# EAGLE design SenseThermo TEC - CRHVEF (EAGLE 9.2.2)
LICENSE: CERN OHL v1.2; REV: CRHVEF; TITLE: SenseTemp TEC; URL: https://github.com/CapableRobot/SenseTemp-TEC

## Sheet 1 of 4
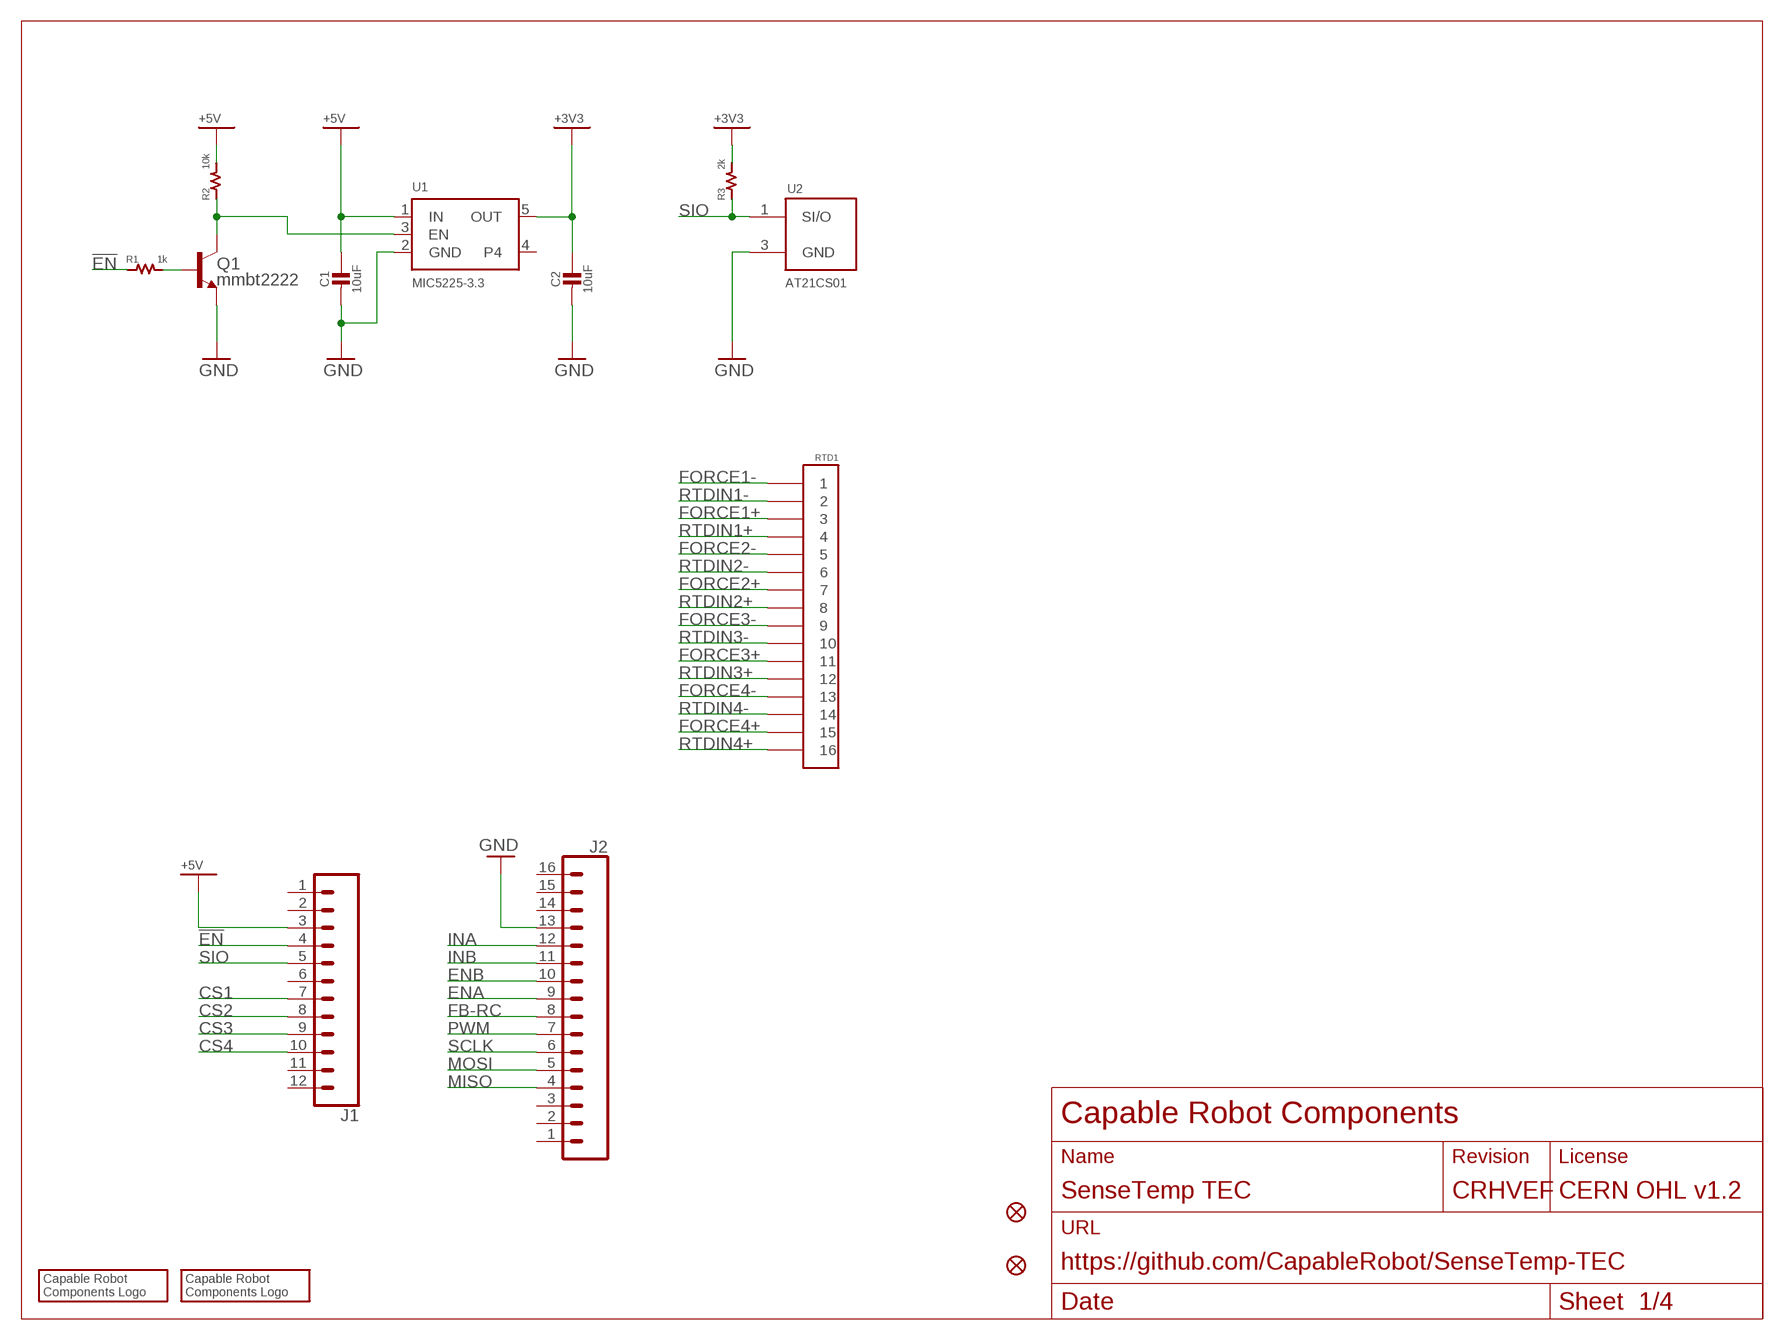
[diagram p0: schematic, sheet 1]

### Parts
C1  10uF  CAP_CERAMIC1206  [1206]
C2  10uF  CAP_CERAMIC1206  [1206]
FID1  FIDUCIAL""  [FIDUCIAL_1MM]
FID2  FIDUCIAL""  [FIDUCIAL_1MM]
J1  CONN_12NO_SILK  [1X12_NO_SILK]
J2  CONN_161X16_NO_SILK  [1X16_NO_SILK]
LOGO1  CRC-LOGO10  [CRC-LOGO-10]
LOGO2  CRC-LOGO5  [CRC-LOGO-5]
Q1  mmbt2222  TRANS_NPN-MMBT2222AL  [SOT23-3]
R1  1k  RES0603  [0603]
R2  10k  RES0603  [0603]
R3  2k  RES0603  [0603]
RTD1  CONN-16ZT  [CONN-2X8-050-SMT-ZT]
U1  MIC5225-3.3  VREG_SOT23-5  [SOT23-5]
U2  AT21CS01  [SOT23]

### Nets
!EN: J1.4 R1.1
+3V3: C2.1 R3.2 U1.5(OUT) ; also sheet 2,3,4
+5V: C1.1 J1.3 R2.2 U1.1(IN)
CS1: J1.7 ; also sheet 2
CS2: J1.8 ; also sheet 2
CS3: J1.9 ; also sheet 3
CS4: J1.10 ; also sheet 3
ENA: J2.9 ; also sheet 4
ENB: J2.10 ; also sheet 4
FB-RC: J2.8 ; also sheet 4
FORCE1+: RTD1.3 ; also sheet 2
FORCE1-: RTD1.1 ; also sheet 2
FORCE2+: RTD1.7 ; also sheet 2
FORCE2-: RTD1.5 ; also sheet 2
FORCE3+: RTD1.11 ; also sheet 3
FORCE3-: RTD1.9 ; also sheet 3
FORCE4+: RTD1.15 ; also sheet 3
FORCE4-: RTD1.13 ; also sheet 3
GND: C1.2 C2.2 J2.13 Q1.2(E) U1.2(GND) U2.3(GND) ; also sheet 2,3,4
INA: J2.12 ; also sheet 4
INB: J2.11 ; also sheet 4
MISO: J2.4 ; also sheet 2,3
MOSI: J2.5 ; also sheet 2,3
N$3: Q1.3(C) R2.1 U1.3(EN)
N$4: Q1.1(B) R1.2
PWM: J2.7 ; also sheet 4
RTDIN1+: RTD1.4 ; also sheet 2
RTDIN1-: RTD1.2 ; also sheet 2
RTDIN2+: RTD1.8 ; also sheet 2
RTDIN2-: RTD1.6 ; also sheet 2
RTDIN3+: RTD1.12 ; also sheet 3
RTDIN3-: RTD1.10 ; also sheet 3
RTDIN4+: RTD1.16 ; also sheet 3
RTDIN4-: RTD1.14 ; also sheet 3
SCLK: J2.6 ; also sheet 2,3
SIO: J1.5 R3.1 U2.1(SI/O)
Unconnected: J1.1 J1.2 J1.6 J1.11 J1.12 J2.1 J2.2 J2.3 J2.14 J2.15 J2.16 U1.4

## Sheet 2 of 4
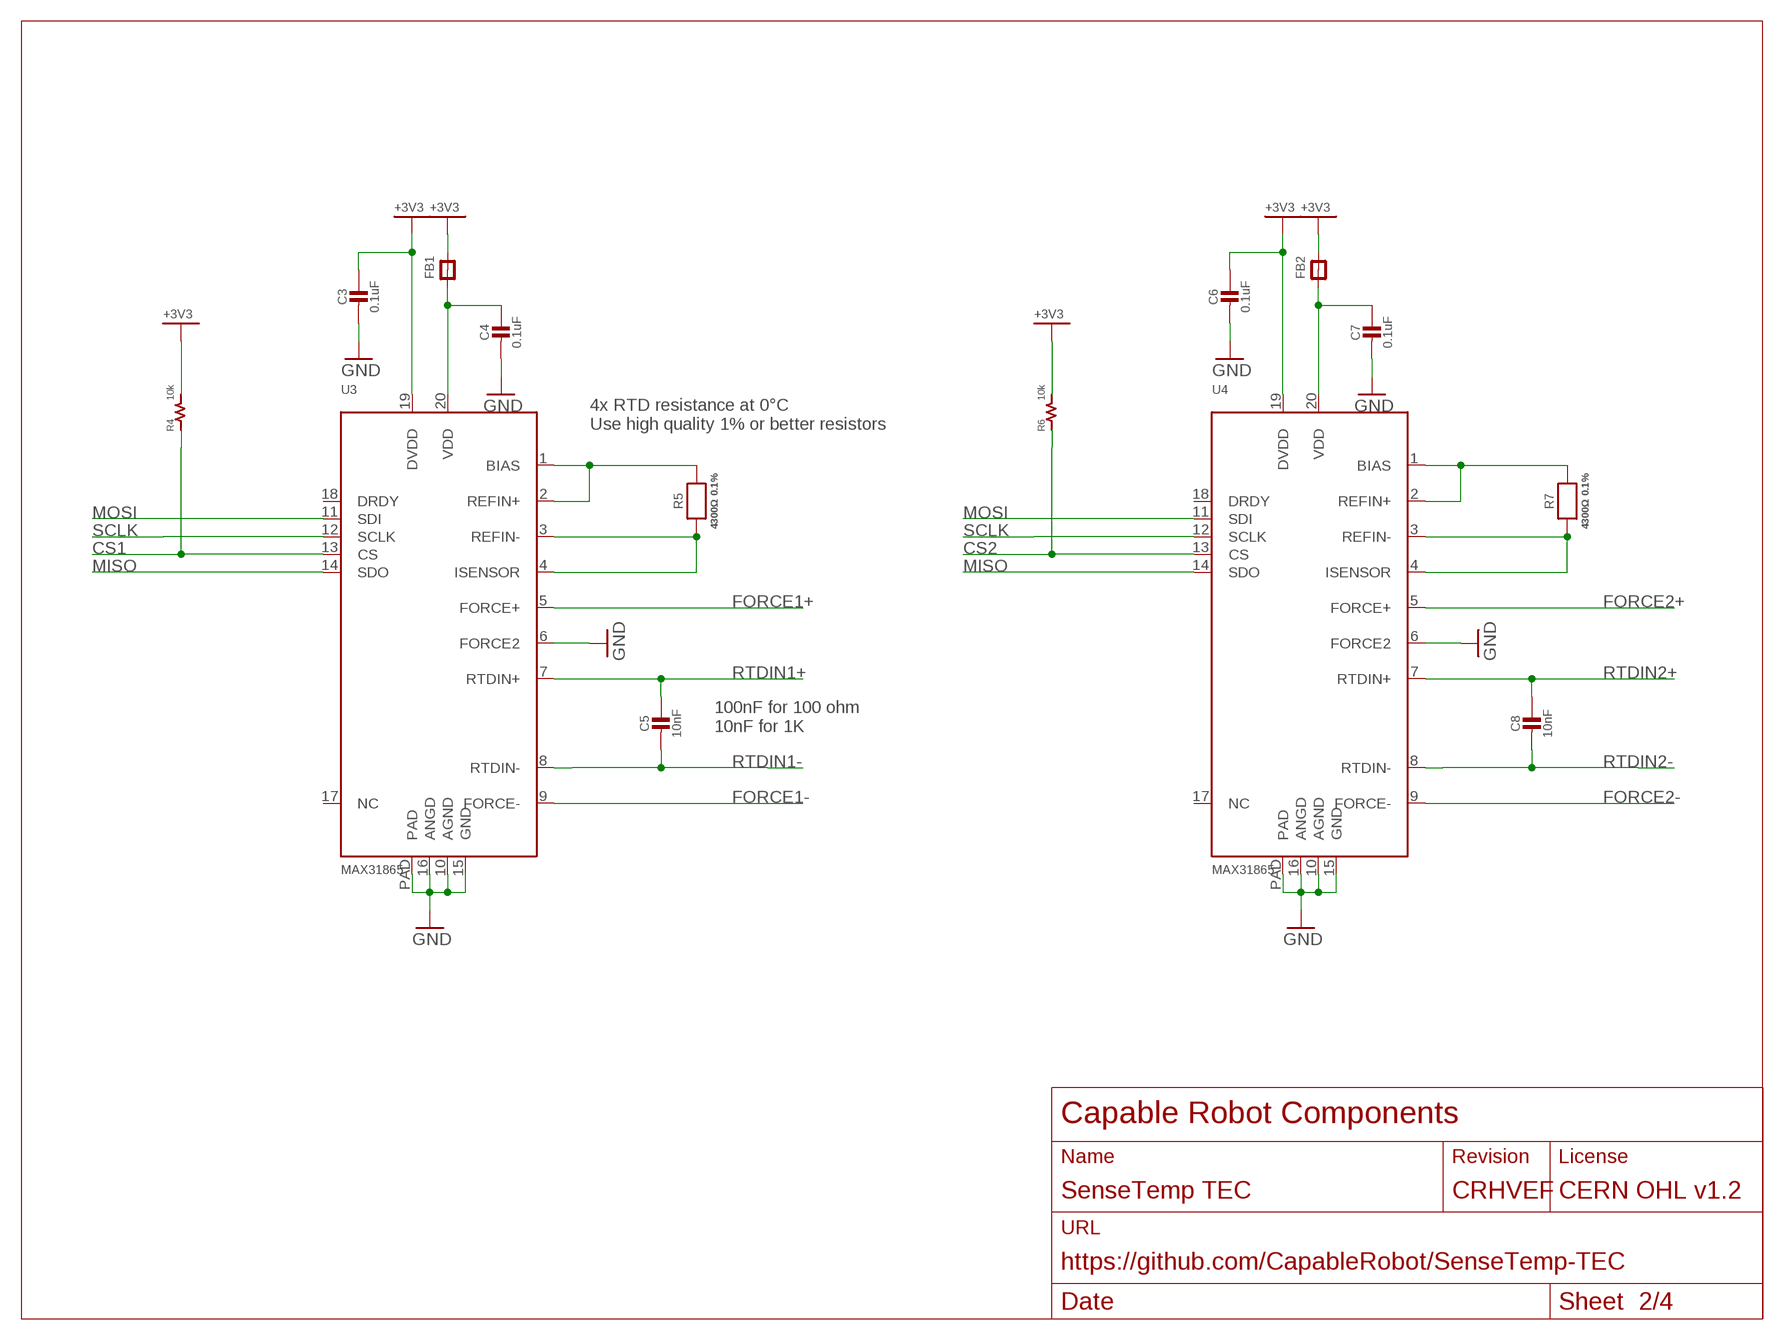
[diagram p1: schematic, sheet 2]

### Parts
C3  0.1uF  CAP_CERAMIC_0805MP  [_0805MP]
C4  0.1uF  CAP_CERAMIC_0805MP  [_0805MP]
C5  10nF  CAP_CERAMIC_0805MP  [_0805MP]
C6  0.1uF  CAP_CERAMIC_0805MP  [_0805MP]
C7  0.1uF  CAP_CERAMIC_0805MP  [_0805MP]
C8  10nF  CAP_CERAMIC_0805MP  [_0805MP]
FB1  FERRITE_0805MP  [_0805MP]
FB2  FERRITE_0805MP  [_0805MP]
R4  10k  RES0603  [0603]
R5  4300Ω 0.1%  RESISTOR_0805MP  [_0805MP]
R6  10k  RES0603  [0603]
R7  4300Ω 0.1%  RESISTOR_0805MP  [_0805MP]
U3  MAX31865  TEMP_MAX31865  [QFN20_4MM_0.65MM]
U4  MAX31865  TEMP_MAX31865  [QFN20_4MM_0.65MM]

### Nets
+3V3: C3.1 C6.1 FB1.2 FB2.2 R4.2 R6.2 U3.19(DVDD) U4.19(DVDD) ; also sheet 1,3,4
CS1: R4.1 U3.13(CS) ; also sheet 1
CS2: R6.1 U4.13(CS) ; also sheet 1
FORCE1+: U3.5(FORCE+) ; also sheet 1
FORCE1-: U3.9(FORCE-) ; also sheet 1
FORCE2+: U4.5(FORCE+) ; also sheet 1
FORCE2-: U4.9(FORCE-) ; also sheet 1
GND: C3.2 C4.2 C6.2 C7.2 U3.6(FORCE2) U3.10(AGND) U3.15(GND) U3.16(ANGD) U3.PAD U4.6(FORCE2) U4.10(AGND) U4.15(GND) U4.16(ANGD) U4.PAD ; also sheet 1,3,4
MISO: U3.14(SDO) U4.14(SDO) ; also sheet 1,3
MOSI: U3.11(SDI) U4.11(SDI) ; also sheet 1,3
N$5: R5.2 U3.1(BIAS) U3.2(REFIN+)
N$6: R5.1 U3.3(REFIN-) U3.4(ISENSOR)
N$7: C4.1 FB1.1 U3.20(VDD)
N$8: R7.2 U4.1(BIAS) U4.2(REFIN+)
N$9: R7.1 U4.3(REFIN-) U4.4(ISENSOR)
N$10: C7.1 FB2.1 U4.20(VDD)
RTDIN1+: C5.1 U3.7(RTDIN+) ; also sheet 1
RTDIN1-: C5.2 U3.8(RTDIN-) ; also sheet 1
RTDIN2+: C8.1 U4.7(RTDIN+) ; also sheet 1
RTDIN2-: C8.2 U4.8(RTDIN-) ; also sheet 1
SCLK: U3.12(SCLK) U4.12(SCLK) ; also sheet 1,3
Unconnected: U3.17(NC) U3.18(DRDY) U4.17(NC) U4.18(DRDY)

### Notes on the sheet
- 4x RTD resistance at 0°C 
  Use high quality 1% or better resistors
- 100nF for 100 ohm
  10nF for 1K

## Sheet 3 of 4
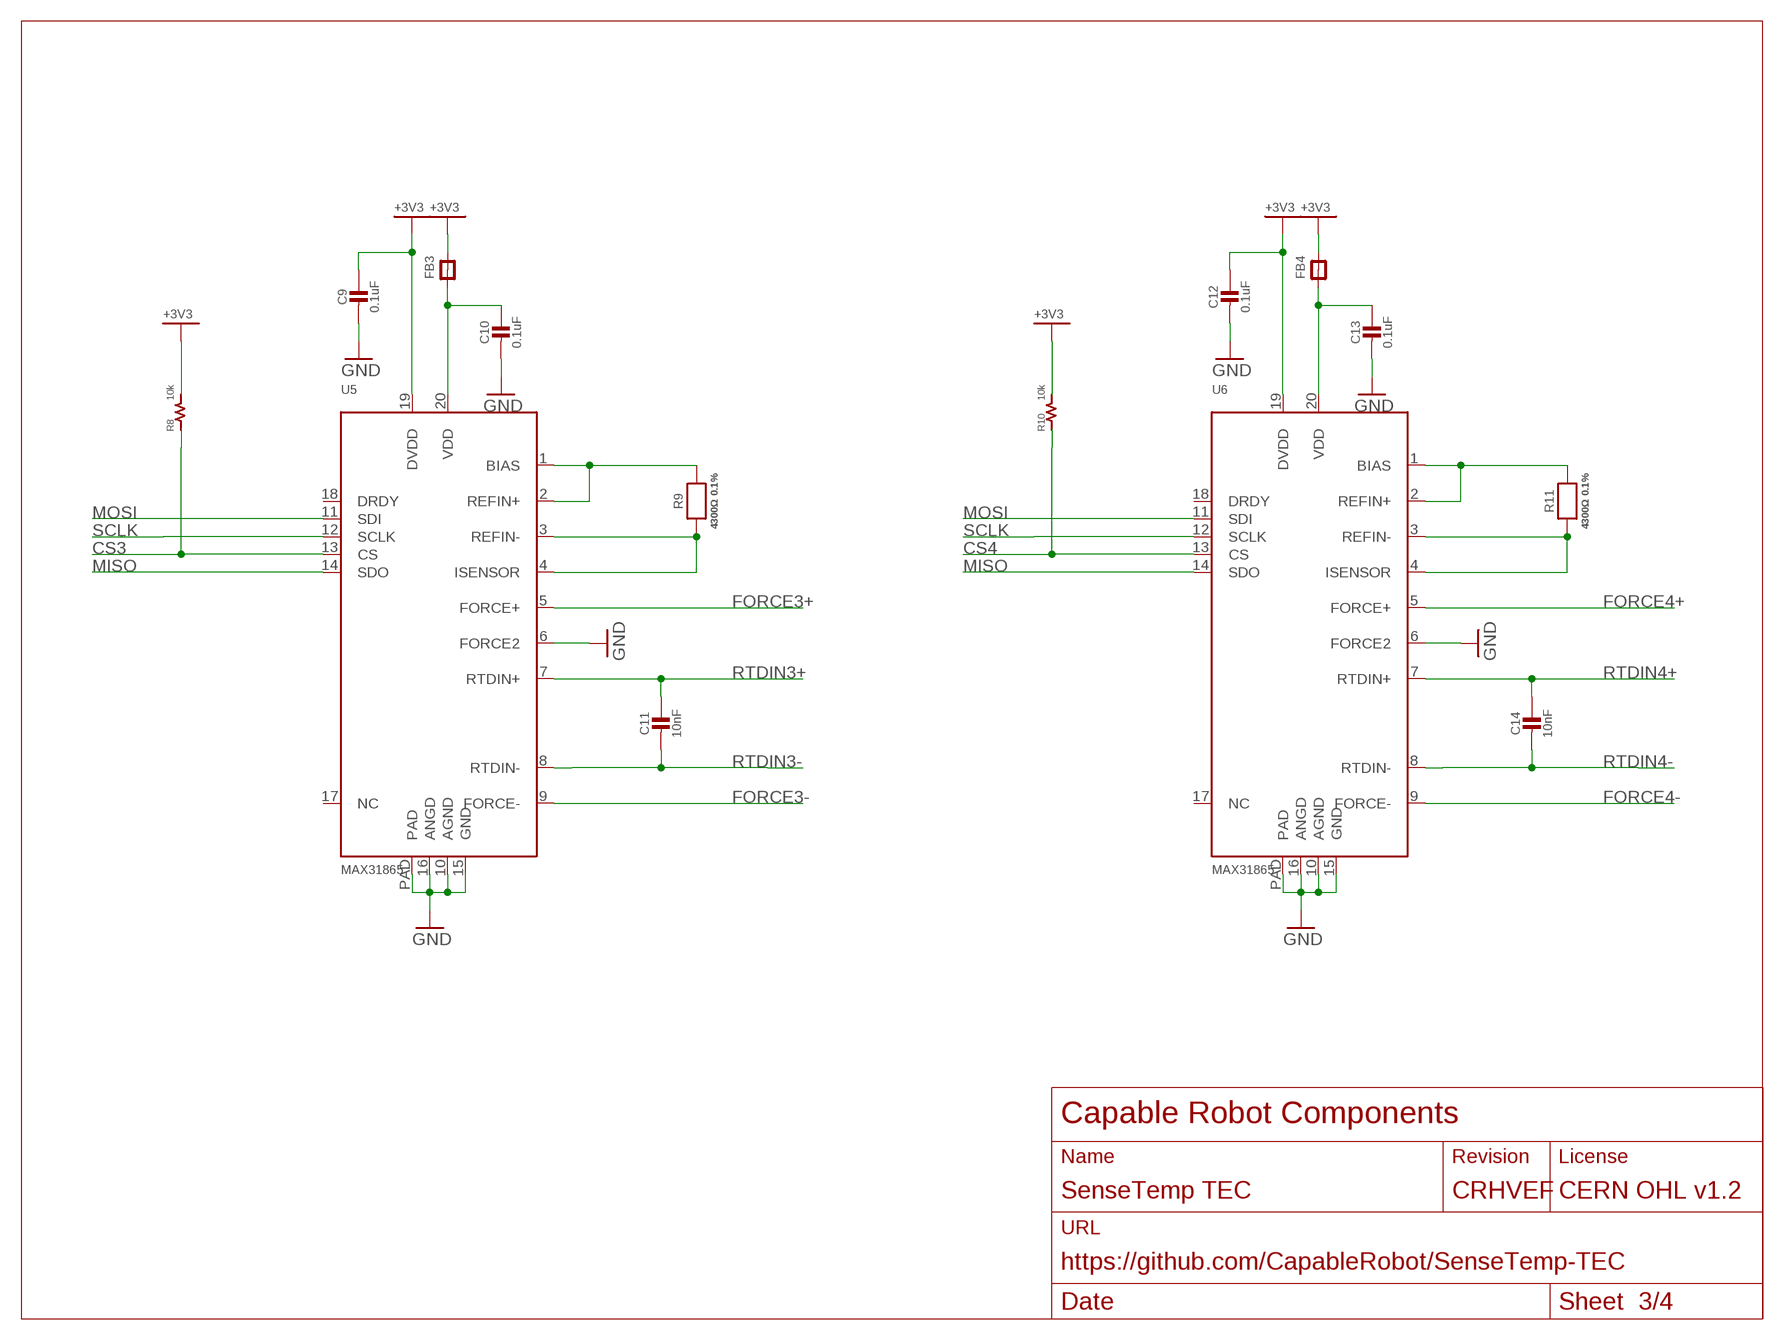
[diagram p2: schematic, sheet 3]

### Parts
C9  0.1uF  CAP_CERAMIC_0805MP  [_0805MP]
C10  0.1uF  CAP_CERAMIC_0805MP  [_0805MP]
C11  10nF  CAP_CERAMIC_0805MP  [_0805MP]
C12  0.1uF  CAP_CERAMIC_0805MP  [_0805MP]
C13  0.1uF  CAP_CERAMIC_0805MP  [_0805MP]
C14  10nF  CAP_CERAMIC_0805MP  [_0805MP]
FB3  FERRITE_0805MP  [_0805MP]
FB4  FERRITE_0805MP  [_0805MP]
R8  10k  RES0603  [0603]
R9  4300Ω 0.1%  RESISTOR_0805MP  [_0805MP]
R10  10k  RES0603  [0603]
R11  4300Ω 0.1%  RESISTOR_0805MP  [_0805MP]
U5  MAX31865  TEMP_MAX31865  [QFN20_4MM_0.65MM]
U6  MAX31865  TEMP_MAX31865  [QFN20_4MM_0.65MM]

### Nets
+3V3: C9.1 C12.1 FB3.2 FB4.2 R8.2 R10.2 U5.19(DVDD) U6.19(DVDD) ; also sheet 1,2,4
CS3: R8.1 U5.13(CS) ; also sheet 1
CS4: R10.1 U6.13(CS) ; also sheet 1
FORCE3+: U5.5(FORCE+) ; also sheet 1
FORCE3-: U5.9(FORCE-) ; also sheet 1
FORCE4+: U6.5(FORCE+) ; also sheet 1
FORCE4-: U6.9(FORCE-) ; also sheet 1
GND: C9.2 C10.2 C12.2 C13.2 U5.6(FORCE2) U5.10(AGND) U5.15(GND) U5.16(ANGD) U5.PAD U6.6(FORCE2) U6.10(AGND) U6.15(GND) U6.16(ANGD) U6.PAD ; also sheet 1,2,4
MISO: U5.14(SDO) U6.14(SDO) ; also sheet 1,2
MOSI: U5.11(SDI) U6.11(SDI) ; also sheet 1,2
N$11: R9.2 U5.1(BIAS) U5.2(REFIN+)
N$12: R9.1 U5.3(REFIN-) U5.4(ISENSOR)
N$13: C10.1 FB3.1 U5.20(VDD)
N$14: R11.2 U6.1(BIAS) U6.2(REFIN+)
N$15: R11.1 U6.3(REFIN-) U6.4(ISENSOR)
N$16: C13.1 FB4.1 U6.20(VDD)
RTDIN3+: C11.1 U5.7(RTDIN+) ; also sheet 1
RTDIN3-: C11.2 U5.8(RTDIN-) ; also sheet 1
RTDIN4+: C14.1 U6.7(RTDIN+) ; also sheet 1
RTDIN4-: C14.2 U6.8(RTDIN-) ; also sheet 1
SCLK: U5.12(SCLK) U6.12(SCLK) ; also sheet 1,2
Unconnected: U5.17(NC) U5.18(DRDY) U6.17(NC) U6.18(DRDY)

## Sheet 4 of 4
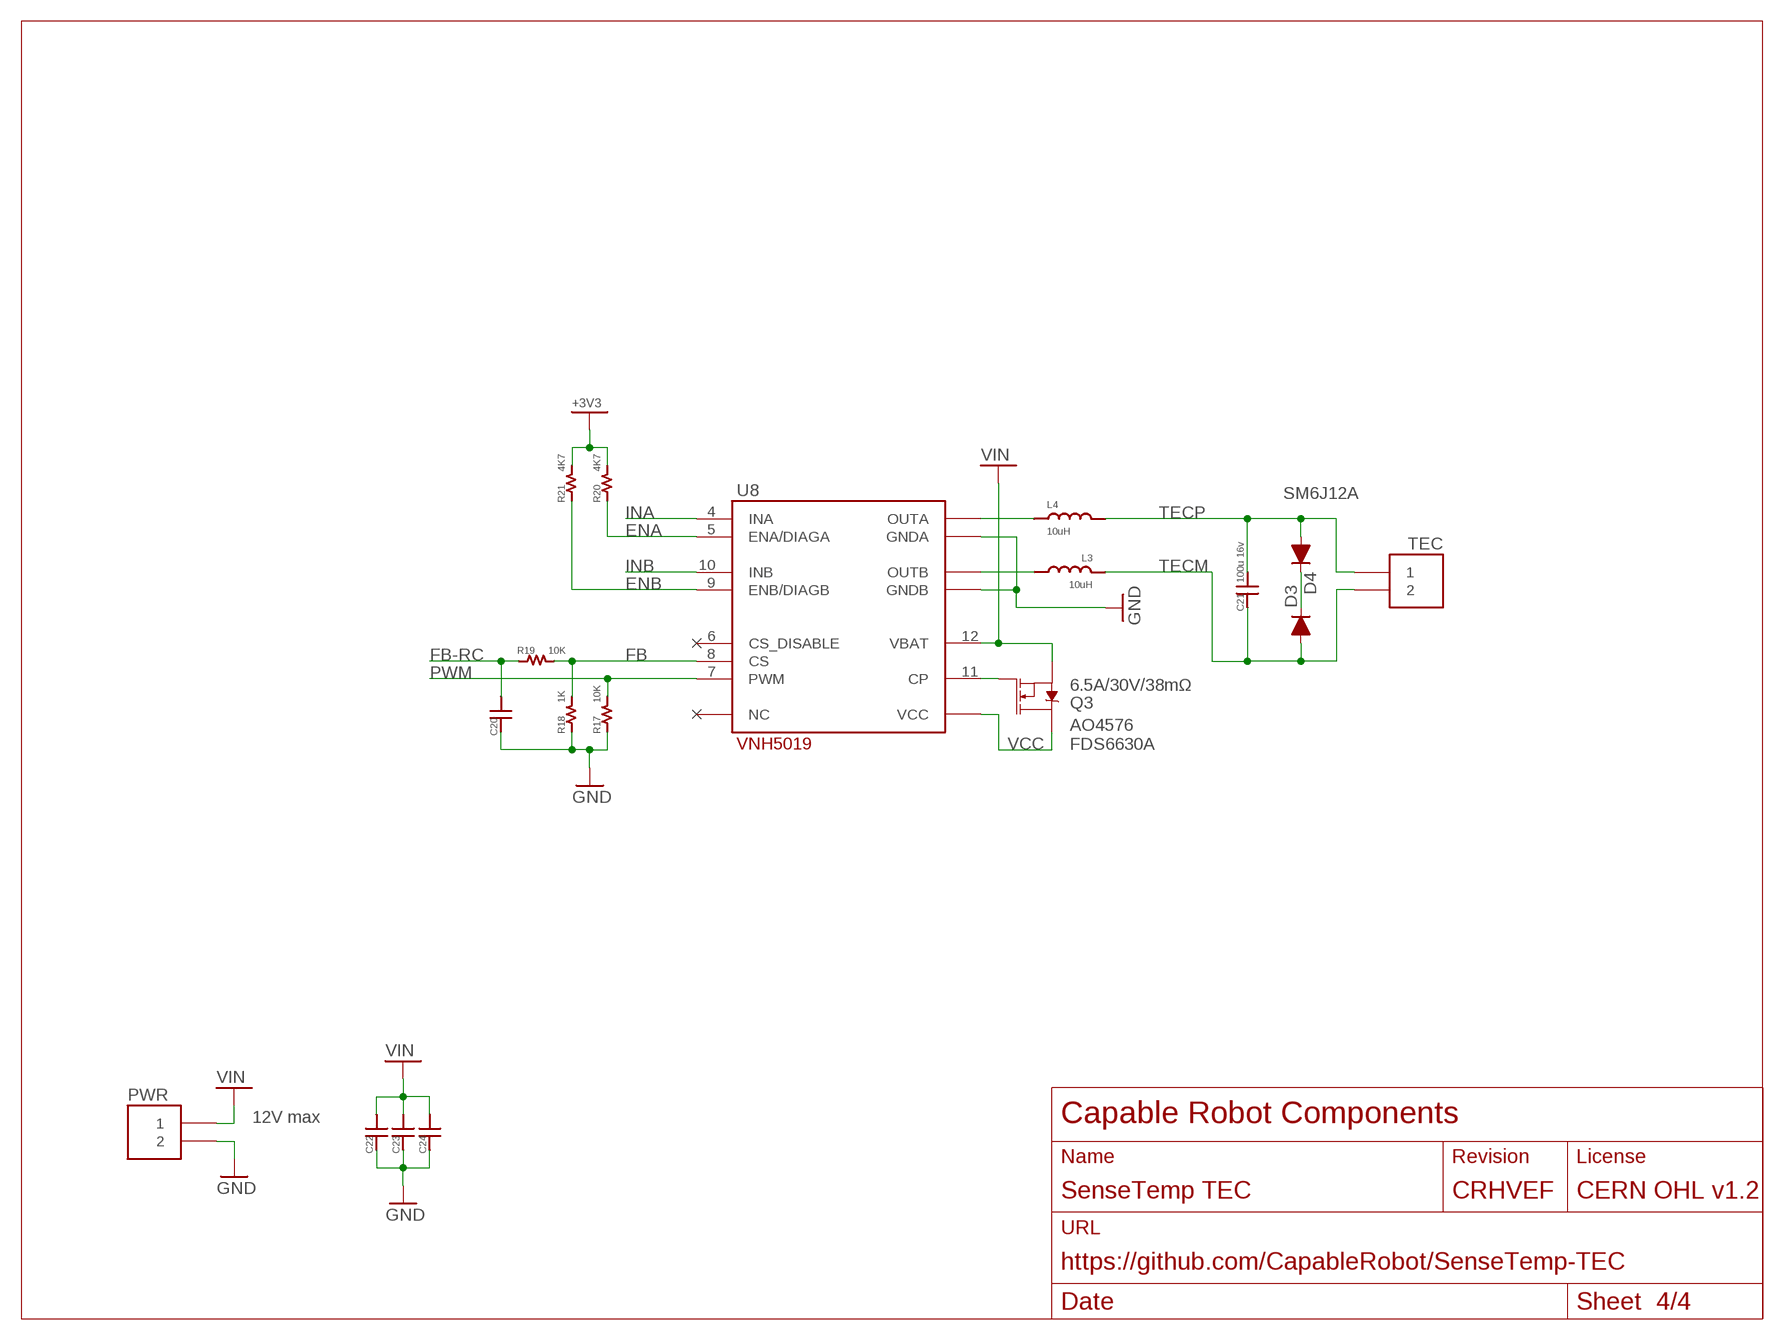
[diagram p3: schematic, sheet 4]

### Parts
C20  CAP0603  [0603]
C21  100u 16v  CAP2220  [2220]
C22  CAP1206  [1206]
C23  CAP1206  [1206]
C24  CAP1206  [1206]
D3  SM6J12A  DIODEDO214AA  [DO214AA]
D4  SMAJ12A  DIODEDO214AA  [DO214AA]
L3  10uH  INDHCF1007  [IND-HCF1007]
L4  10uH  INDHCF1007  [IND-HCF1007]
PWR  CONN-2-MFJR-RA  [CONN-MFJR-RA-2X1]
Q3  6.5A/30V/38mΩ  MOSFET-NCH-FDS6630A  [SO08]
R17  10K  RES0603  [0603]
R18  1K  RES0603  [0603]
R19  10K  RES0603  [0603]
R20  4K7  RES0603  [0603]
R21  4K7  RES0603  [0603]
TEC  CONN-2-MFJR-RA  [CONN-MFJR-RA-2X1]
U8  VNH5019  [SOP100P1900X235-30-EP]

### Nets
+3V3: R20.2 R21.2 ; also sheet 1,2,3
CP1: Q3.4(G) U8.11(CP)
ENA: R20.1 U8.5(ENA/DIAGA) ; also sheet 1
ENB: R21.1 U8.9(ENB/DIAGB) ; also sheet 1
FB: R18.2 R19.2 U8.8(CS)
FB-RC: C20.2 R19.1 ; also sheet 1
GND: C20.1 C22.P$1 C23.P$1 C24.P$1 PWR.2 R17.1 R18.1 U8.18(GNDB) U8.19(GNDB) U8.20(GNDB) U8.26(GNDA) U8.27(GNDA) U8.28(GNDA) ; also sheet 1,2,3
INA: U8.4(INA) ; also sheet 1
INB: U8.10(INB) ; also sheet 1
OUTA1: L4.1 U8.1(OUTA) U8.25(OUTA) U8.30(OUTA) U8.OUTA
OUTB1: L3.2 U8.15(OUTB) U8.16(OUTB) U8.21(OUTB) U8.OUTB
PWM: R17.2 U8.7(PWM) ; also sheet 1
SNUB1: D3.C D4.C
TECM: C21.1 D3.A L3.1 TEC.2
TECP: C21.2 D4.A L4.2 TEC.1
VCC: Q3.5(D) Q3.6(D) Q3.7(D) Q3.8(D) U8.3(VCC) U8.13(VCC) U8.23(VCC) U8.VCC
VIN: C22.P$2 C23.P$2 C24.P$2 PWR.1 Q3.1(S) Q3.2(S) Q3.3(S) U8.12(VBAT)
Unconnected: U8.2(NC) U8.6(CS_DISABLE) U8.14(NC) U8.17(NC) U8.22(NC) U8.24(NC) U8.29(NC)

### Notes on the sheet
- AO4576
  FDS6630A
- 12V max

## Library data of the parts
C1-C14 = microbuilder:CAP_CERAMIC: Ceramic Capacitors 0402 - 0402 Surface Mount Capacitors 16pF 50V 5% [Digikey: 445-4899-2-ND] 18pF 50V 5% [Digikey: 490-1281-2-ND] 22pF 50V 5% [Digikey: 490-1283-2-ND] 68pF 50V 5% [Digikey: 490-1289-2-ND] 0.1uF 10V 10% [Digikey: 490-1318-2-ND] 1.0uF 6.3V 10% [Digikey: 490-1320-2-ND] 0603 - 0603 Surface Mount Capacitors 16 pF 50V 5% [Digikey: 445-5051-2-ND] 22 pF 50V [Digikey: PCC220ACVTR-ND] 33 pF 50V 5% [Digikey: 490-1415-1-ND] 56pF 50V 5% [Digikey: 490-1421-1-ND] 220pF 50V 5% [Digikey: 445-1285-1-ND] 680 pF 50V 2200 pF 50V 5% C0G [Digikey: 445-1297-1-ND] 5600 pF 100V 5% X7R [Digikey: 478-3711-1-ND] 0.1 µF 25V 10% [Digikey: PCC2277TR-ND] 0.22 µF 16V 10% X7R [Digikey: 445-1318-1-ND] 1.0 µF 25V 10% [Digikey: 445-5146-2-ND] 0603 - RF Specific 3pF 250V +/-0.1pF RF [Digikey: 712-1347-1-ND] 18 pF 250V 5% [Digikey: 478-3505-1-ND or 712-1322-1-ND] 56 pF 250V 5% C0G RF [Digikey: 490-4867-1-ND] 68 pF 250V RF [Digikey: 490-4868-1-ND] 0805 - 0805 Surface Mount Capacitors 220 pF 250V 2% RF Ceramic Capacitor [Digikey: 712-1398-1-ND] 1000 pF 50V 2% NP0 Ceramic Capacitor [Digikey: 478-3760-1-ND] 0.1 µF 25V 10% Ceramic Capacitor [Digikey: PCC1828TR-ND] 1.0 µF 16V 10% Ceramic Capacitor[Digikey: 490-1691-2-ND] 10.0 µF 10V 10% Ceramic Capacitor[Digikey: 709-1228-1-ND] 10.0 uF 16V 10% Ceramic Capacitor [Digikey: 478-5165-2-ND] 47 uF 6.3V 20% Ceramic Capacitor [Digikey: 587-1779-1-ND or 399-5506-1-ND] 1206 - 1206 Surface Mount Capacitors 47uF 10V 20% Ceramic Capacitor [Digikey: 490-5528-1-ND or 399-5508-1-ND or 445-6010-1-ND] 100uF 6.3V -20%, +80% Y5V Ceramic Capacitor (Digikey: 490-4512-1-ND, Mouser: 81-GRM31CF50J107ZE1L)
C20-C24 = CapableRobot:CAP
D3 D4 = EEZ MyLib7:DIODE
FB1-FB4 = microbuilder:FERRITE: Ferrite Bead 0603 MMZ1608B121C - 120 Ohm @ 100MHz, 600mA, 0.15 Ohm DC Resistance - Digikey: 445-2164-1-ND BK1608HW121-T - 120 Ohm, 600mA Ferrite Chip - Digikey: 587-1876-2-ND 0805 HZ0805B272R-10 - 2.7K Ohm @ 100MHz, 200mA, 0.8 Ohm DC Resistance - Digikey: 240-2504-1-ND (see also Murata BLM21BD272SN1L) MMZ2012Y152B - 1.5K Ohm @ 100MHz, 500mA, 0.4 Ohm DC Resistance - Digikey: 445-1560-1-ND - Mainly for high frequency (80-400MHz) MMZ2012R102A - 1K Ohm @ 100MHz, 500mA, 0.3 Ohm DC Resistance - Digikey: 445-1555-2-ND - More general purpose (10-200MHz)
FID1 FID2 = microbuilder:FIDUCIAL: Fiducial Alignment Points Various fiducial points for machine vision alignment.
J1 = SparkFun-Connectors:CONN_12: Multi connection point. Often used as Generic Header-pin footprint for 0.1 inch spaced/style header connections On any of the 0.1 inch spaced packages, you can populate with these: Break Away Headers - Straight <https://www.sparkfun.com/products/116> (PRT-00116) Break Away Male Headers - Right Angle <https://www.sparkfun.com/products/553> (PRT-00553) Female Headers <https://www.sparkfun.com/products/115> (PRT-00115) Break Away Headers - Machine Pin <https://www.sparkfun.com/products/117> (PRT-00117) Break Away Female Headers - Swiss Machine Pin <https://www.sparkfun.com/products/743> (PRT-00743) For SCREWTERMINALS and SPRING TERMINALS visit here: Screw Terimnals on SparkFun.com <https://www.sparkfun.com/search/results?term=Screw+Terminals> (5mm/3.5mm/2.54mm spacing) This device is also useful as a general connection point to wire up your design to another part of your project. Our various solder wires solder well into these plated through hole pads. Hook-Up Wire - Assortment (Stranded, 22 AWG) <https://www.sparkfun.com/products/11375> (PRT-11375) Hook-Up Wire - Assortment (Solid Core, 22 AWG) <https://www.sparkfun.com/products/11367> (PRT-11367) View the entire wire category on our website here <https://www.sparkfun.com/categories/141> Special notes: Molex polarized connector foot print use with SKU : PRT-08231 with associated crimp pins and housings. 1MM SMD Version SKU: PRT-10208 NOTES ON THE VARIANTS LOCK and LOCK_LONGPADS... This footprint was designed to help hold the alignment of a through-hole component (i.e. 6-pin header) while soldering it into place. You may notice that each hole has been shifted either up or down by 0.005 of an inch from it's more standard position (which is a perfectly straight line). This slight alteration caused the pins (the squares in the middle) to touch the edges of the holes. Because they are alternating, it causes a "brace" to hold the component in place. 0.005 has proven to be the perfect amount of "off-center" position when using our standard breakaway headers. Although looks a little odd when you look at the bare footprint, once you have a header in there, the alteration is very hard to notice. Also,if you push a header all the way into place, it is covered up entirely on the bottom side.
J2 = SparkFun-Connectors:CONN_16: Multi connection point. Often used as Generic Header-pin footprint for 0.1 inch spaced/style header connections On any of the 0.1 inch spaced packages, you can populate with these: Break Away Headers - Straight <https://www.sparkfun.com/products/116> (PRT-00116) Break Away Male Headers - Right Angle <https://www.sparkfun.com/products/553> (PRT-00553) Female Headers <https://www.sparkfun.com/products/115> (PRT-00115) Break Away Headers - Machine Pin <https://www.sparkfun.com/products/117> (PRT-00117) Break Away Female Headers - Swiss Machine Pin <https://www.sparkfun.com/products/743> (PRT-00743) For SCREWTERMINALS and SPRING TERMINALS visit here: Screw Terimnals on SparkFun.com <https://www.sparkfun.com/search/results?term=Screw+Terminals> (5mm/3.5mm/2.54mm spacing) This device is also useful as a general connection point to wire up your design to another part of your project. Our various solder wires solder well into these plated through hole pads. Hook-Up Wire - Assortment (Stranded, 22 AWG) <https://www.sparkfun.com/products/11375> (PRT-11375) Hook-Up Wire - Assortment (Solid Core, 22 AWG) <https://www.sparkfun.com/products/11367> (PRT-11367) View the entire wire category on our website here <https://www.sparkfun.com/categories/141> Special notes: Molex polarized connector foot print use with SKU : PRT-08231 with associated crimp pins and housings. 1MM SMD Version SKU: PRT-10208 NOTES ON THE VARIANTS LOCK and LOCK_LONGPADS... This footprint was designed to help hold the alignment of a through-hole component (i.e. 6-pin header) while soldering it into place. You may notice that each hole has been shifted either up or down by 0.005 of an inch from it's more standard position (which is a perfectly straight line). This slight alteration caused the pins (the squares in the middle) to touch the edges of the holes. Because they are alternating, it causes a "brace" to hold the component in place. 0.005 has proven to be the perfect amount of "off-center" position when using our standard breakaway headers. Although looks a little odd when you look at the bare footprint, once you have a header in there, the alteration is very hard to notice. Also,if you push a header all the way into place, it is covered up entirely on the bottom side.
L3 L4 = CapableRobot:IND: Shielded Power Inductor 1212 - Bourns SRFN03500145 1212 - Murata LQH3N SRN4018 - Bourns (4 x 4 x 2) MSS5131 - Coilcraft MSS5131 (5.1 x 5.1 x 3.1) SD53 - Cooper Ind SD53 (5.2 x 5.2 x 3.0) octagonal
LOGO1 LOGO2 = CapableRobot:CRC-LOGO
PWR TEC = CapableRobot:CONN-2
Q1 = SparkFun-DiscreteSemi:TRANS_NPN: NPN transistor Current controlled devices typically used to amplify current or used as a switch. BC547 - COM-08928 <http://www.sparkfun.com/products/8928> (TO-92 45V 100mA) (1.Collector 2.Base 3.Emitter) 2N3904 - COM-00521 <http://www.sparkfun.com/products/521> (TO-92 40V 200mA) (1.Emitter 2.Base 3.Collector) P2N2222A - COM-12852 <http://www.sparkfun.com/products/12852> (TO-92 40V 600mA) (1.Collector 2.Base 3.Emitter); PROD_ID: TRANS-08049; VALUE: 600mA/40V
Q3 = SparkFun-DiscreteSemi:MOSFET-NCH: N-channel MOSFETs Voltage controlled devices that allow control of high current outputs. SparkFun Products: SparkFun OpenScale <https://www.sparkfun.com/products/13261> SparkFun Digital Sandbox <https://www.sparkfun.com/products/12651> SparkFun Monster Moto Shield <https://www.sparkfun.com/products/10182> SparkFun MOSFET Power Controller <https://www.sparkfun.com/products/11214>; PROD_ID: TRANS-08089
R1-R4 R6 R8 R10 R17-R21 = CapableRobot:RES
R5 R7 R9 R11 = microbuilder:RESISTOR: Resistors 0402 - 0402 Surface Mount Package 22 Ohm 1% 1/16W [Digikey: 311-22.0LRTR-ND] 33 Ohm 5% 1/16W 1.0K 5% 1/16W 1.5K 5% 1/16W 2.0K 1% 1/16W 10.0K 1% 1/16W [Digikey: 311-10.0KLRTR-ND] 10.0K 5% 1/16W [Digikey: RMCF0402JT10K0TR-ND] 12.1K 1% 1/16W [Digikey: 311-22.0LRTR-ND] 100.0K 5% 1/16W 0603 - 0603 Surface Mount Package 0 Ohm 1/10 Watt 1% Resistor 15 Ohm 1/10 Watt 1% Resistor 33 Ohm 1/10 Watt 1% Resistor 49.9 Ohm 1/10 Watt 1% Resistor 100 Ohm 1/10 Watt 1% Resistor 150 Ohm 1/10 Watt 1% Resistor 240 Ohm 1/10 Watt 1% Resistor 390 Ohm 1/10 Watt 1% Resistor 560 Ohm 1/10 Watt 1% Resistor 680 Ohm 1/10 Watt 1% Resistor 750 Ohm 1/10 Watt 1% Resistor 1.0K Ohm 1/10 Watt 1% Resistor 1.5K Ohm 1/10 Watt 1% Resistor 2.0K Ohm 1/10 Watt 1% Resistor 2.2K Ohm 1/10 Watt 1% Resistor 3.3K Ohm 1/10 Watt 1% Resistor 4.7K Ohm 1/10 Watt 1% Resistor 10.0K Ohm 1/10 Watt 1% Resistor 12.0K Ohm 1/10 Watt 1% Resistor 12.1K Ohm 1/10 Watt 1% Resistor 20.0K Ohm 1/10 Watt 1% Resistor 33.0K Ohm 1/10 Watt 1% Resistor 100.0K Ohm 1/10 Watt 1% Resistor 0805 - 0805 Surface Mount Package 0 Ohm 1/8 Watt 1% Resistor 33 Ohm 1/8 Watt 1% Resistor 100 Ohm 1/8 Watt 1% Resistor 150 Ohm 1/8 Watt 1% Resistor 200 Ohm 1/8 Watt 1% Resistor 240 Ohm 1/8 Watt 1% Resistor 330 Ohm 1/8 Watt 1% Resistor 390 Ohm 1/8 Watt 1% Resistor 470 Ohm 1/8 Watt 1% Resistor 1.0K Ohm 1/8 Watt 1% Resistor 1.5K Ohm 1/8 Watt 1% Resistor 2.0K Ohm 1/8 Watt 1% Resistor 4.7K Ohm 1/8 Watt 1% Resistor 5.1K Ohm 1/8 Watt 1% Resistor 5.6K Ohm 1/8 Watt 1% Resistor 10.0K Ohm 1/8 Watt 1% Resistor 22.0K Ohm 1/8 Watt 1% Resistor 33.0K Ohm 1/8 Watt 1% Resistor 100K Ohm 1/8 Watt 1% Resistor 1206 - 1206 Surface Mount Package 2012 - 2010 Surface Mount Package 0.11 Ohm 1/2 Watt 1% Resistor - Digikey: RHM.11UCT-ND
RTD1 = CapableRobot:CONN-16
U1 = microbuilder:VREG_SOT23-5: SOT23-5 Fixed Voltage Regulators To better organise some of the SOT23-5 fixed voltage regulators in this library, this new part was created. Part Current Out V Out V In V Dropout Digikey Part No. ADP121 150mA 3.3V 3.4-5.5V 0.09V @ 150mA ADP121-AUJZ33R7CT-ND ADP121 150mA 3.0V 3.1-5.5V 0.09V @ 150mA ADP121-AUJZ30R7CT-ND ADP122 300mA 3.3V 3.4-5.5V 0.085V @ 300mA ADP122AUJZ-3.3-R7CT-ND ADP1712 300mA 3.3V 3.5-5.5V 0.17V @ 300mA ADP1712AUJZ-3.3-R7TR-ND AP7311 (Low Cost) 150mA 3.3V 3.5-6V 0.15V @ 150mA AP7311-33WG-7DICT-ND LD39015M18R 150mA 1.8V 1.9V-5.5V 0.08V @ 100mA 497-6977-1-ND MCP1824T-3302E/OT 300mA 3.3V 3.5V-6V 0.2V @ 300mA MCP1824T-3302E/OTCT-ND MIC5205-2.5YM5 TR 150mA 2.5V 2.7-16V 0.165V @ 150mA 576-1257-2-ND MIC5205-3.0YM5 TR 150mA 3.0V 3.2V-16V 0.165V @ 150mA 576-1258-2-ND MIC5205-3.3YM5 TR 150mA 3.3V 3.5V-16V 0.165V @ 150mA 576-1259-2-ND TPS780330220 150mA 3.3V+2.2V 3.6-5.5V 250mV Max 296-23332-1-ND TDA3663/N1,135 100mA 3.3V 3.5-45V 0.18V @ 50mA 568-5343-1-ND
U2 = CapableRobot:AT21CS01: Single-Wire, I/O Powered 1-Kbit (128 x 8) Serial EEPROM with a Unique, Factory-Programmed 64-Bit Serial Number
U3-U6 = microbuilder:TEMP_MAX31865: MAX31865 - Resistance to Digital Convertor for Platinum Resistance Temperature Detectors (RTDs) Handles 100 ohm - 1K ohm (at 0°C) platinum RTDs. 15-bit ADC resolution (nominally 0.03125°C), 0.5°C accuracy.
U8 = CapableRobot:VNH5019

## Board
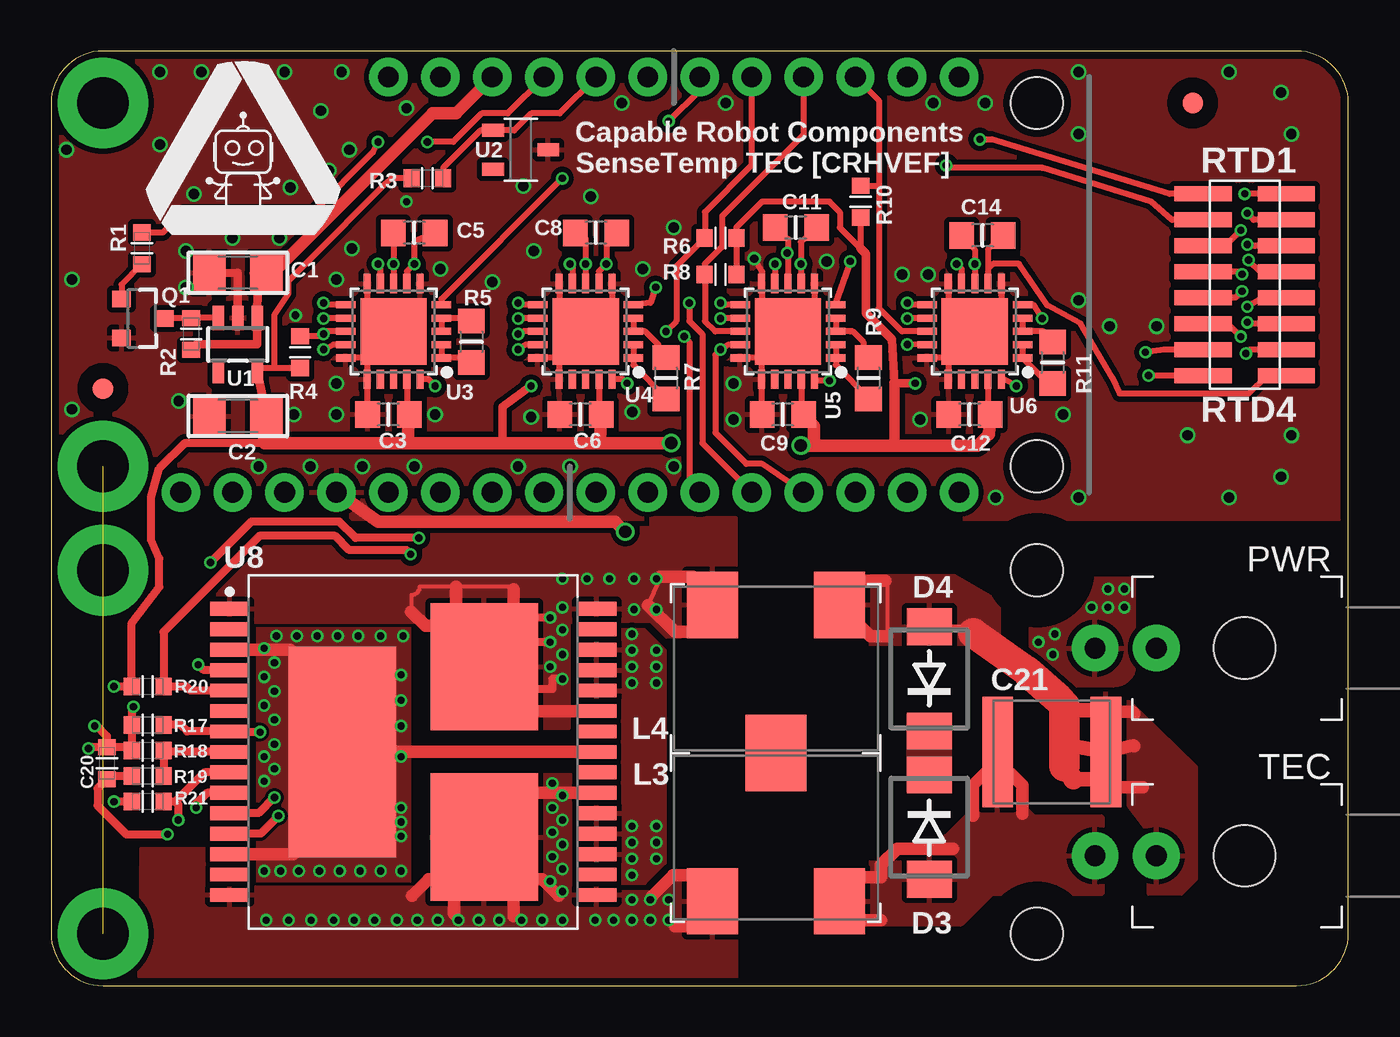
[diagram p4: board, top side]
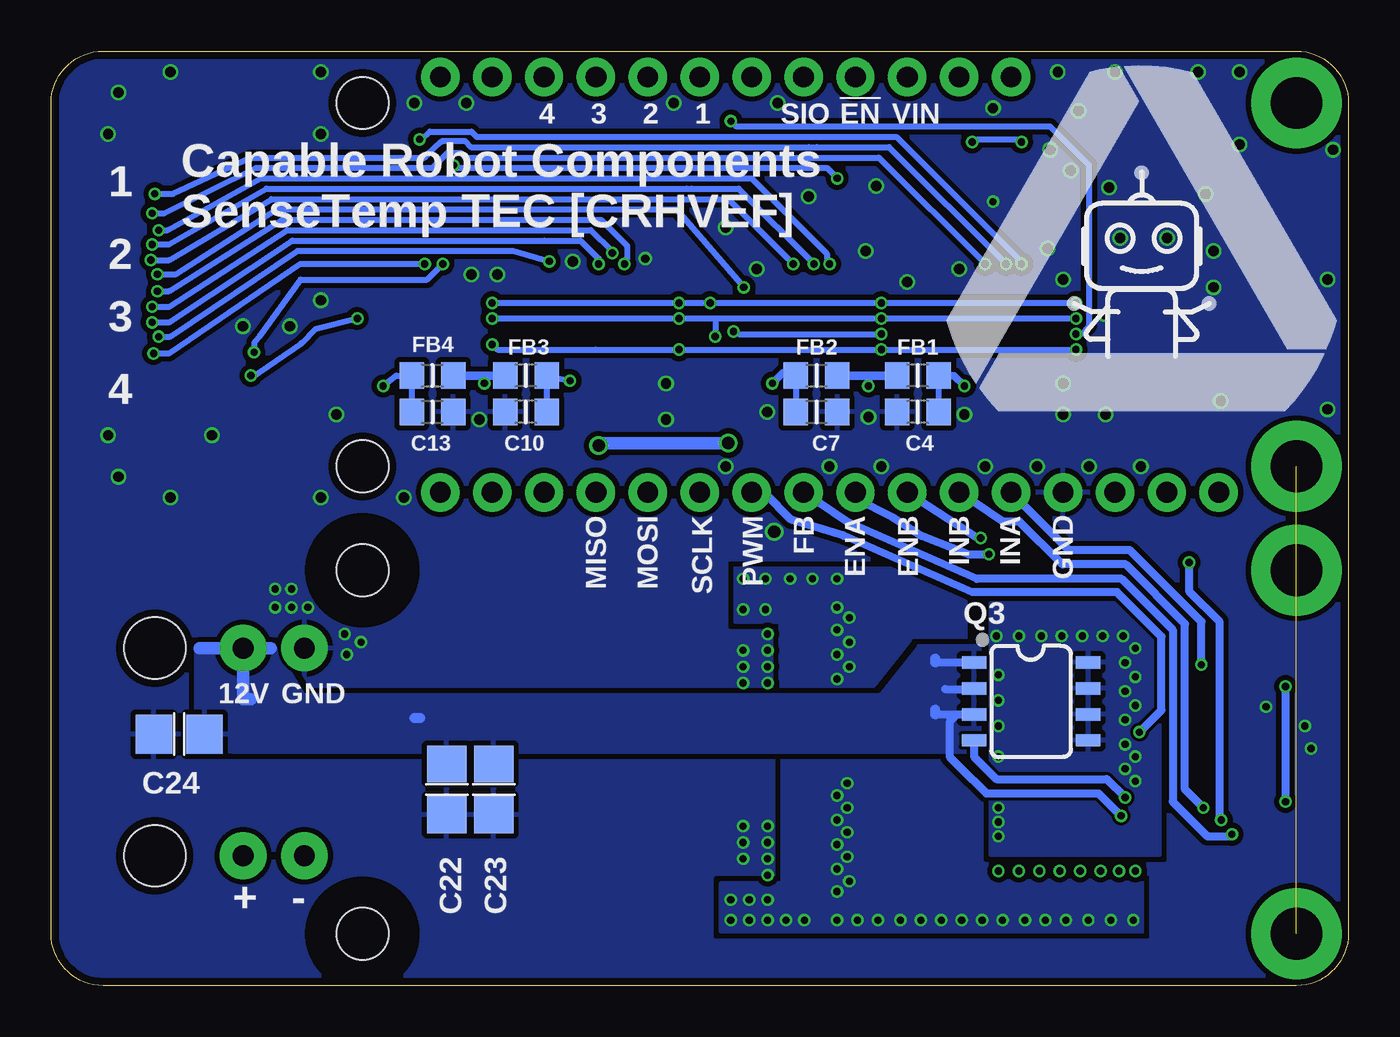
[diagram p5: board, bottom side, seen from below]

Size 63.5 x 45.72 mm. Coordinates in mm from the lower left corner, seen from the top.
Outline: 0,43.18 0,2.54 arc90 2.54,0 60.96,0 arc90 63.5,2.54 63.5,43.18 arc90 60.96,45.72 2.54,45.72 arc90 0,43.18
Copper layers (1*16): Top 0.035559375mm / dielectric 1.6mm / Bottom 0.035559375mm
Design rules "oshpark-2layer-tented *": minimum track width 6mil, minimum drill 10mil, track to track 6mil, track to pad 6mil, pad to pad 6mil, via to via 6mil, smd to smd 6mil, copper to edge 15mil, drill to drill 6mil, minimum pad ring 5mil, minimum via ring 5mil, stop-mask expansion 2.5mil, vias tented up to drill 25mil, thermal gap 10mil
Holes 2.54 mm at 48.26,25.4 48.26,43.18 48.26,2.54 48.26,20.32
tRestrict: area 8.6,29 to 9.7,30.6; area 45.7,17.8 to 50.8,22.9; area 45.7,0 to 50.8,5.1
bRestrict: area 45.7,0 to 50.8,5.1; area 45.7,17.8 to 50.8,22.9

### Footprints (pad centres in the part's own frame; a part is rotated, then mirrored left to right if it is on the bottom)
1206 = smd 1.6 x 1.8: 1 -1.4,0; 2 1.4,0
_0805MP = smd 1.2 x 1.3: 1 -1.016,0; 2 1.016,0
0603 = smd 0.79 x 0.86: 1 -0.775,0; 2 0.775,0
2220 = smd 1.5 x 5.4: 1 -2.65,0; 2 2.65,0
1206' = smd 1.803 x 1.918: P$1 -1.238,0; P$2 1.238,0
DO214AA = smd 1.8 x 2.2: A 2.55,0; C -2.55,0
FIDUCIAL_1MM = smd 1 x 1: 1 0,0
1X12_NO_SILK = drill 1.016 pad 1.88: 1 0,0; 2 2.54,0; 3 5.08,0; 4 7.62,0; 5 10.16,0; 6 12.7,0; 7 15.24,0; 8 17.78,0; 9 20.32,0; 10 22.86,0; 11 25.4,0; 12 27.94,0
1X16_NO_SILK = drill 1.016 pad 1.88: 1 0,0; 2 2.54,0; 3 5.08,0; 4 7.62,0; 5 10.16,0; 6 12.7,0; 7 15.24,0; 8 17.78,0; 9 20.32,0; 10 22.86,0; 11 25.4,0; 12 27.94,0; 13 30.48,0; 14 33.02,0; 15 35.56,0; 16 38.1,0
IND-HCF1007 = smd 3.25 x 2.5: 1 -3.125,-3.1; 2 -3.125,3.1 | smd 2.5 x 3: P$1 3.5,0
CONN-MFJR-RA-2X1 = drill 1.02 pad 2.286: 1 0,4.32; 2 0,7.32 | hole 3: 0,0
SOT23-3 = smd 0.8 x 0.9: 1 -0.95,-1; 2 0.95,-1; 3 0,1.1
SO08 = smd 0.6 x 1.2: 1 -1.905,-2.8; 2 -0.635,-2.8; 3 0.635,-2.8; 4 1.905,-2.8; 5 1.905,2.8; 6 0.635,2.8; 7 -0.635,2.8; 8 -1.905,2.8
CONN-2X8-050-SMT-ZT = smd 0.737 x 2.794: 1 4.445,2.032; 2 4.445,-2.032; 3 3.175,2.032; 4 3.175,-2.032; 5 1.905,2.032; 6 1.905,-2.032; 7 0.635,2.032; 8 0.635,-2.032; 9 -0.635,2.032; 10 -0.635,-2.032; 11 -1.905,2.032; 12 -1.905,-2.032; 13 -3.175,2.032; 14 -3.175,-2.032; 15 -4.445,2.032; 16 -4.445,-2.032
SOT23-5 = smd 0.55 x 1.2: 1 -0.95,-1.3; 2 0,-1.3; 3 0.95,-1.3; 4 0.95,1.3; 5 -0.95,1.3
SOT23 = smd 0.635 x 1.067: 1 0.95,1.346; 2 -0.95,1.346; 3 0,-1.346
QFN20_4MM_0.65MM = smd 0.35 x 0.95: 1 -1.3,-2.34; 2 -0.65,-2.34; 3 0,-2.34; 4 0.65,-2.34; 5 1.3,-2.34; 11 1.3,2.34; 12 0.65,2.34; 13 0,2.34; 14 -0.65,2.34; 15 -1.3,2.34 | smd 0.95 x 0.35: 6 2.34,-1.3; 7 2.34,-0.65; 8 2.34,0; 9 2.34,0.65; 10 2.34,1.3; 16 -2.34,1.3; 17 -2.34,0.65; 18 -2.34,0; 19 -2.34,-0.65; 20 -2.34,-1.3 | smd 3.25 x 3.25: PAD 0,0
SOP100P1900X235-30-EP = smd 1.91 x 0.675: 1 -8.98,7; 2 -8.98,6; 3 -8.98,5; 4 -8.98,4; 5 -8.98,3; 6 -8.98,2; 7 -8.98,1; 8 -8.98,0; 9 -8.98,-1; 10 -8.98,-2; 11 -8.98,-3; 12 -8.98,-4; 13 -8.98,-5; 14 -8.98,-6; 15 -8.98,-7; 16 8.98,-7; 17 8.98,-6; 18 8.98,-5; 19 8.98,-4; 20 8.98,-3; 21 8.98,-2; 22 8.98,-1; 23 8.98,0; 24 8.98,1; 25 8.98,2; 26 8.98,3; 27 8.98,4; 28 8.98,5; 29 8.98,6; 30 8.98,7 | smd 5.25 x 6.23: OUTA 3.475,4.165; OUTB 3.475,-4.165 | smd 5.25 x 10.3: VCC -3.475,0

### Placement (x,y rotation side)
C1  9.14,34.87 180 top
C2  9.14,27.86 180 top
C3  16.51,27.94 180 top
C4  21.08,28.07 180 bottom
C5  17.78,36.83 180 top
C6  25.91,27.94 180 top
C7  26.04,28.07 0 bottom
C8  26.67,36.83 180 top
C9  35.81,27.94 180 top
C10  40.26,28.07 180 bottom
C11  36.45,37.08 180 top
C12  44.96,27.94 180 top
C13  44.83,28.07 0 bottom
C14  45.59,36.7 180 top
C20  2.73,10.88 270 top
C21  48.98,11.43 0 top
C22  [1206']  44.13,9.6 90 bottom
C23  [1206']  41.83,9.6 90 bottom
C24  [1206']  57.23,12.3 0 bottom
D3  42.98,7.75 270 top
D4  42.98,15 90 top
FB1  21.08,29.84 180 bottom
FB2  26.04,29.84 0 bottom
FB3  40.26,29.84 180 bottom
FB4  44.83,29.84 0 bottom
FID1  2.54,29.21 90 top
FID2  55.88,43.18 90 top
J1  16.51,44.45 0 top
J2  44.45,24.13 180 top
L3  35.48,7.25 90 top
L4  35.48,15.5 270 top
LOGO1  10.12,35.12 0 bottom
LOGO2  9.4,40.26 0 top
PWR  58.42,16.51 90 top
Q1  4.45,32.64 270 top
Q3  15.53,13.9 270 bottom
R1  4.45,36.07 270 top
R2  6.86,31.88 270 top
R3  18.41,39.5 180 top
R4  12.19,30.99 270 top
R5  20.57,31.5 270 top
R6  32.77,36.58 0 top
R7  30.1,29.72 270 top
R8  32.77,34.8 0 top
R9  40.01,29.72 270 top
R10  39.62,38.35 270 top
R11  49.02,30.48 270 top
R17  4.73,12.75 0 top
R18  4.73,11.5 0 top
R19  4.73,10.25 0 top
R20  4.73,14.63 180 top
R21  4.73,9 180 top
RTD1  58.42,34.29 90 top
TEC  58.42,6.35 90 top
U1  9.14,31.37 180 top
U2  22.99,40.89 90 top
U3  16.76,32 90 top
U4  26.16,32 90 top
U5  36.07,32 90 top
U6  45.21,32 90 top
U8  17.73,11.43 0 top

### Tracks (layer width: path | path; a pad name or v marks a point on that pad's centre or on a via)
!EN  (via drill 0.35)
  Top 0.305: R1.1 5.47,36.84 6.48,37.85 12.83,37.85 15.75,40.77 v16,41.27 | J1.4 22.35,42.67 21.08,42.67 19.68,41.27 v18.41,41.27
  Bottom 0.305: v18.41,41.27 18.16,41.4 16.13,41.4 v16,41.27
+3V3  (via drill 0.35, 0.36, 0.61)
  Top 0.305: U4.19 26.81,27.99 C6.1 | U3.19 17.41,27.99 C3.1 | 12.05,30.07 R4.2 10.92,30.21 | R6.2 33.49,36.63 | U6.19 45.86,27.99 C12.1 | U5.19 36.72,27.99 C9.1 37.27,27.43 | 10.92,30.21 10.24,30.21 U1.5 | R6.2 R8.2 | R10.2 39.62,36.07 38.61,37.08 38.61,37.85 38.1,38.35 34.8,38.35 33.53,37.08 33.54,37.07 R6.2 | R3.2 16.64,39.5 16.38,39.24 12.5,35.36 11.61,34.47 11.61,33.86 10.92,32.82 10.92,30.21
  Top 0.4: R21.2 v3.08,9 | v3.08,14.63 R20.2 3.96,17.75 5.3,19.5 5.3,20.9 4.9,21.8 4.9,23.9 5.3,25.3 6.54,26.54 10.46,26.54
  Top 0.406: C2.1 U1.5 | 39.62,36.07 39.88,35.81 39.88,32.89 41.15,31.62 41.27,29.46 v42.29,29.46 | 22.1,26.54 22.1,28.32 v23.5,29.34
  Top 0.508: 41.27,29.46 41.27,26.42
  Top 0.61: 17.46,26.54 20.07,26.54 22.1,26.54 26.92,26.54 | v30.35,26.54 26.92,26.54 | 37.34,26.42 v36.7,26.42 36.76,26.48 | 37.34,26.42 38.23,26.42 41.27,26.42 45.34,26.42 45.91,26.98 C12.1 | 26.92,26.54 26.86,26.61 C6.1 | 17.46,26.54 10.46,26.54 10.41,26.59 C2.1 | C3.1 17.46,26.54 | C9.1 37.34,27.37 37.34,26.42
  Bottom 0.4: v3.08,14.63 v3.08,9
  Bottom 0.406: 23.5,29.84 v23.5,29.34 | FB4.2 42.29,29.84 v42.29,29.46 42.16,29.84 FB3.2 | 23.5,29.84 FB1.2 | FB2.2 23.5,29.84
  Bottom 0.61: v30.35,26.54 36.58,26.54 v36.7,26.42
+5V
  Top 0.406: 9.91,34.86 C1.1 10.41,34.49 10.11,34.19 U1.1 10.09,31.37 7.12,31.37 R2.2
  Top 0.61: C1.1 10.67,34.67 18.67,42.67 19.81,42.67 J1.3
CP1  (via drill 0.35)
  Top 0.4: U8.11 10.16,8.43 v10.93,9.2
  Bottom 0.4: Q3.4 18.33,11.2 17.23,10.1 11.83,10.1 v10.93,9.2
CS1  (via drill 0.36)
  Top 0.305: U3.13 13.46,32 v13.34,31.88 13.22,31.76 R4.1 | v30.23,42.29 31.75,43.81 J1.7
  Bottom 0.305: v13.34,31.88 13.08,31.88 12.7,32.26 12.7,40.13 14.61,42.04 29.97,42.04 v30.23,42.29
CS2  (via drill 0.36)
  Top 0.305: v22.86,31.88 23.11,32 U4.13 | v30.1,32 30.61,32.51 30.61,35.19 32,36.59 | 31.99,36.82 R6.1 32,36.59 | J1.8 34.29,40.13 32,37.85 32,36.59
  Bottom 0.305: v22.86,31.88 29.84,31.88 v30.1,32
CS3
  Top 0.305: 33.7,31.98 U5.13 32.51,32 32,32.51 32,35.31 | R8.1 32,34.81 32,35.31 | J1.9 36.83,41.63 32.84,37.64 32.84,36.14 32,35.31
CS4
  Top 0.305: 40.51,39.12 40.51,33.15 41.66,32 U6.13 | R10.1 39.64,39.12 40.51,39.12 | J1.10 40.51,43.31 40.51,39.12
ENA  (via drill 0.35)
  Top 0.4: U8.5 6.83,14.43 6.63,14.63 R20.1 5.5,17.3 10.2,22 13.9,22 14.6,21.3 17.4,21.3 v17.6,21.1
  Bottom 0.4: v17.6,21.1 18.6,21.1 20.9,22 22.3,22.9 24.13,23.83 J2.9
ENB  (via drill 0.35)
  Top 0.4: U8.9 7.51,10.43 6.08,9 | 6.08,9 5.53,9 | 5.53,9 R21.1 | 5.53,9 | v7.8,20.7 9.8,22.7 14.1,22.7 14.9,21.9 v18,21.9 | 6.08,9 6.23,8.85 v6.23,8.1
  Bottom 0.4: J2.10 18.16,21.9 v18,21.9 | v6.23,8.1 6.33,8.2 6.33,17.83 7.8,19.3 v7.8,20.7
FB
  Top 0.4: U8.8 5.58,11.43 | 5.58,11.43 R18.2 | R19.2 5.5,11.36 5.58,11.43
FB-RC  (via drill 0.35)
  Top 0.4: R19.1 2.88,10.25 C20.2 2.28,9.65 2.28,8.8 3.68,7.4 v5.7,7.4
  Bottom 0.4: J2.8 24.54,22.7 18.2,19.9 11.1,19.9 8.6,17.4 8.6,9 6.9,7.3 5.8,7.3 v5.7,7.4
FORCE1+  (via drill 0.36)
  Top 0.305: U3.5 19.1,33.58 v25.02,39.5 | v43.81,40.13 43.94,40.01 48.51,40.01 53.85,38.35 54.86,37.47 RTD1.3
  Bottom 0.305: v25.02,39.5 25.53,40.01 43.69,40.01 v43.81,40.13
FORCE1-  (via drill 0.35, 0.36)
  Top 0.305: U3.9 16.11,35.07 v16,35.31 | RTD1.1 54.74,38.73 46.02,41.4 v45.47,41.4
  Bottom 0.305: v16,35.31 16.15,35.46 16.15,35.56 22.12,41.53 42.67,41.53 42.93,41.78 44.96,41.78 45.34,41.4 v45.47,41.4
FORCE2+  (via drill 0.35, 0.36)
  Top 0.305: v29.59,34.16 29.34,33.4 U4.5 | v58.29,34.8 58.1,34.92 RTD1.7
  Bottom 0.305: v29.59,34.16 32.89,37.97 52.45,37.97 57.4,34.8 v58.29,34.8
FORCE2-  (via drill 0.35, 0.36)
  Top 0.305: U4.9 25.51,35.19 v25.4,35.31 | RTD1.5 57.47,36.2 v58.23,36.96
  Bottom 0.305: v25.4,35.31 25.53,35.43 25.53,35.81 29.21,39.5 47.62,39.5 | 47.88,39.5 47.62,39.5 | 47.62,39.5 53.21,39.5 57.78,36.96 v58.23,36.96
FORCE3+  (via drill 0.35, 0.36)
  Top 0.305: U5.5 38.41,33.45 v39.12,35.43 | v58.23,31.75 57.59,32.38 RTD1.11
  Bottom 0.305: v39.12,35.43 40.89,35.94 51.44,35.94 57.66,31.75 v58.23,31.75
FORCE3-  (via drill 0.35, 0.36)
  Top 0.305: U5.9 35.43,34.36 v35.43,35.31 | v58.29,33.97 57.98,33.66 57.47,33.66 RTD1.9
  Bottom 0.305: v35.43,35.31 35.43,35.43 35.31,35.56 35.31,36.2 35.81,36.7 36.58,37.47 52.2,37.47 57.72,33.97 v58.29,33.97
FORCE4+  (via drill 0.35, 0.36)
  Top 0.305: U6.5 48.1,33.3 v48.51,32.64 | RTD1.15 v53.72,29.84
  Bottom 0.305: v48.51,32.64 50.55,32.13 51.24,31.43 53.72,29.72 v53.72,29.84
FORCE4-  (via drill 0.35, 0.36)
  Top 0.305: U6.9 44.56,35.07 v44.32,35.31 | v53.57,30.99 54.45,31.11 RTD1.13
  Bottom 0.305: v44.32,35.31 45.09,34.54 51.3,34.54 53.28,31.8 53.53,31.5 v53.57,30.99
GND  (via drill 0.35, 0.36, 0.38, 0.41, 0.51, 0.6)
  Top 0.305: C6.2 24.86,28.04 | 24.86,30.7 U4.16 | 24.89,30.73 24.86,30.7 | 24.86,30.7 U4.15 | U4.10 24.89,34.31 24.89,33.15 26.04,32 U4.PAD | 15.46,28.04 U3.16 15.46,30.7 | 18.06,33.3 U3.PAD | U3.PAD 15.46,30.7 | U3.10 15.46,33.3 U3.PAD | 15.46,30.7 U3.15 | U4.6 27.46,33.3 27.43,33.27 | U5.10 34.8,34.31 34.8,34.04 | 34.8,34.04 34.8,33.27 | 34.77,30.7 U5.16 34.77,28.04 | 34.8,30.73 34.77,30.7 | 34.77,30.7 U5.15 | v34.42,35.56 34.8,34.92 34.8,34.04 | U5.6 37.37,33.3 | U6.6 46.51,33.78 46.51,33.3 | 43.94,34.31 U6.10 43.91,33.3 U6.PAD 43.91,30.7 | 43.91,30.7 U6.15 | 43.91,30.7 U6.16 | C12.2 43.91,28.04
  Top 0.4: v4.03,13.64 4.03,13.6 3.96,13.53 R17.1 R18.1 3.81,11.65 C20.1 | C20.1 1.98,11.65 v1.83,11.6 | C20.1 2.73,12.2 2.23,12.7 v2.13,12.7
  Top 0.406: U1.2 9.14,34.87 8.19,34.86 C1.2 | 46.51,33.3 U6.PAD | U5.PAD 34.77,30.7
  Top 0.6: J2.13 16,22.7 27.6,22.7 v28.1,22.2
  other vias: 11.18,36.58 8.88,36.58 6.6,35.94 6.6,34.16 6.25,28.6 11.89,27.94 13.97,29.46 13.97,27.94 10.16,25.4 12.7,25.4 15.24,25.4 17.78,25.4 22.86,25.4 25.4,25.4 33.4,29.46 41.66,34.8 42.93,34.8 43.18,43.18 45.72,43.18 60.71,41.66 60.2,43.69 50.29,44.7 57.66,44.7 60.71,26.92 60.2,24.89 50.29,23.88 57.66,23.88 13.59,39.88 14.22,44.7 11.43,44.7 7.37,44.7 5.33,41.15 0.76,40.89 1.02,34.54 1.02,28.19 23.5,27.81 18.8,27.94 28.45,28.07 30.48,25.4 33.4,27.69 42.55,27.69 46.23,23.88 49.53,27.94 55.63,26.92 50.29,41.66 37.97,35.43 30.48,37.08 28.96,35.05 26.42,38.61 23.11,39.12 19.05,35.05 21.59,34.42 17.4,38.35 14.73,36.07 13.97,34.54 14.61,40.89 23.62,35.94 11.71,39.04 13.21,42.8 27.94,43.18 5.33,44.7 33.02,43.18 11.96,32.79 6.99,38.73 17.4,42.93 54.1,32.26 51.82,32.26 28.43,14.8 29.63,14.8 29.63,15.6 29.63,16.4 28.43,15.6 28.43,16.4 28.43,17.2 28.43,5.4 29.63,6.2 29.63,7 29.63,7.8 28.43,6.2 28.43,7 28.43,7.8 52.53,19.4 52.53,18.5 51.73,18.5 50.93,18.5 51.73,19.4 49.03,16.2 49.13,17.2 48.33,16.8 50.29,33.53
  pour Bottom (isolate 0.254, rank 6): 0,0 63.5,0 63.5,48.26 0,48.26
  pour Top (isolate 0.25): 25.83,17.4 29.03,17.4 30.03,16.4 30.03,6 29.03,5 25.83,5
  pour Top (isolate 0.254): 47.93,19.9 47.93,14.7 52.03,14.7 arc90 53.03,15.7 53.03,19.9
  pour Top (isolate 0.254): 0,31.75 0,22.86 12.7,22.86 63.5,22.86 63.5,38.1 63.5,45.72 33.02,45.72 0,45.72
INA  (via drill 0.35)
  Top 0.4: 8.72,15.4 U8.4 7.47,15.43 v7.2,15.7
  Bottom 0.4: v7.2,15.7 7.2,17.8 10.7,21.3 13.68,21.3 J2.12
INB  (via drill 0.35)
  Top 0.4: U8.10 7.63,9.43 7.1,8.9 v7.1,8.7
  Bottom 0.4: J2.11 16.92,22.7 16.1,22.7 14,20.6 10.9,20.6 8,17.7 8,9.6 v7.1,8.7
MISO  (via drill 0.36)
  Top 0.305: U6.14 42.43,31.35 v41.91,31.37 | U5.14 33.16,31.35 v32.77,31.11 32.51,30.86 32.51,27.05 34.04,25.53 34.8,25.53 J2.4 | U3.14 13.83,31.35 v13.34,31.11 | U4.14 23.23,31.35 v22.86,31.11
  Bottom 0.305: v41.91,31.37 41.66,31.11 36.83,31.11 v32.77,31.11 v22.86,31.11 v13.34,31.11
MOSI  (via drill 0.36)
  Top 0.305: U6.11 42.13,33.3 v41.91,33.4 41.78,33.4 | U5.11 32.99,33.3 v32.77,33.4 | U3.11 13.43,33.3 v13.34,33.4 | U4.11 22.96,33.3 v22.86,33.4 | J2.5 31.88,26.54 31.88,31.88 31.24,32.51 v31.24,33.4
  Bottom 0.305: v41.91,33.4 v32.77,33.4 v31.24,33.4 v22.86,33.4 v13.34,33.4
N$1  (via drill 2.54 pad 4.45)  (2 unrouted)
  other vias: 2.54,25.4 2.54,2.54 2.54,20.32
N$2  (via drill 2.54 pad 4.45)
  other vias: 2.54,43.18
N$3
  Top 0.305: U1.3 6.88,32.67 R2.1 5.56,32.65 Q1.3
N$4
  Top 0.305: Q1.1 3.44,34.29 R1.2
N$5
  Top 0.305: U3.2 U3.1 20.67,30.7 R5.2
N$6
  Top 0.305: U3.3 U3.4 20.62,32.65 R5.1
N$7  (via drill 0.36)
  Top 0.305: U3.20 18.47,29.66 v18.8,29.34
  Bottom 0.305: FB1.1 C4.1
  Bottom 0.356: v18.8,29.34 19.3,29.84 FB1.1
N$8
  Top 0.305: U4.2 U4.1 28.5,30.36 R7.2
N$9
  Top 0.305: U4.4 U4.3 29.08,32 29.72,31.37 29.72,31.05 R7.1
N$10  (via drill 0.36)
  Top 0.305: U4.20 27.99,29.66 v28.19,29.46
  Bottom 0.305: FB2.1 C7.1
  Bottom 0.356: v28.19,29.46 27.69,29.97 FB2.1
N$11
  Top 0.305: U5.2 U5.1 38.41,30.36 R9.2
N$12
  Top 0.305: R9.1 39.75,30.92 39.75,31.5 39.24,32 39.12,32 U5.3 U5.4 38.42,32.64
N$13  (via drill 0.36)
  Top 0.305: U5.20 37.44,29.59 v38.1,29.59
  Bottom 0.305: v38.1,29.59 FB3.1 C10.1
N$14
  Top 0.305: U6.2 U6.1 48.73,29.53 R11.2
N$15
  Top 0.305: U6.4 U6.3 48.58,32 R11.1
N$16  (via drill 0.36)
  Top 0.305: v47.24,29.34 46.57,29.72 U6.20
  Bottom 0.305: v47.24,29.34 46.61,29.84 FB4.1 C13.1
OUTA1  (via drill 0.35)
  Top 0.2: 22.63,19.4 arc-90 22.53,19.5 19.83,19.5 18.03,19.5 arc-90 17.63,19.1 17.63,18.3 | 29.83,20 29.23,18.6
  Top 0.4: v24.43,18 23.21,18 23.21,17.6 | v24.43,16.8 22.77,16.8 22.77,17.16 | v25.03,15 24.53,15 24.53,14.5 23.23,14.5 23.23,14.6
  Top 0.6: U8.25 23.37,13.43 U8.OUTA | 29.83,20 31.43,20 32.38,19.05 L4.1 31.53,17.77 31.53,17.3 30.53,17.3 29.23,18.6 | U8.OUTA 22.63,17.02 22.63,19.4 | U8.OUTA 19.83,16.97 19.83,19.5 | 23.21,17.6 22.77,17.16 U8.OUTA | U8.OUTA 19.2,17.6 18.33,17.6 17.63,18.3
  other vias: 24.43,15.6 25.03,16.2 25.03,17.4 25.03,18.5 28.53,18.4 29.63,18.4 28.53,19.9 29.63,19.9 27.33,19.9 26.23,19.9 25.03,19.9
  pour Top (isolate 0.25, rank 2): 33.53,22.86 7.93,22.86 7.93,17.8 29.13,17.8 29.83,17.1 33.53,17.1
  pour Bottom (isolate 0.25, rank 2): 18.73,20.4 30.03,20.4 30.03,17.8 27.83,17.8 27.83,14.6 18.73,14.6
  pour Top (isolate 0.25, rank 2): 21.23,18.6 25.33,18.6 25.33,12.6 21.23,12.6
OUTB1  (via drill 0.35)
  Top 0.6: U8.21 23.37,9.43 U8.OUTB | 30.53,2.9 31.45,2.9 32.38,3.83 L3.2 31.43,5.08 31.43,5.4 30.43,5.4 29.43,4.4 | U8.OUTB 21.2,6.33 22.63,4.9 22.63,3.4 | U8.OUTB 21.2,5.97 19.73,4.5 19.73,3.5 | U8.OUTB 23.27,5.2 24.03,5.2 24.83,4.4 | U8.OUTB 19.14,5.2 18.48,5.2 17.68,4.4
  other vias: 24.53,9.9 25.03,9.3 24.53,8.7 25.03,8.1 24.53,7.5 25.03,6.9 24.53,6.3 25.03,5.7 24.43,5.1 25.03,4.6 28.43,4.2 28.43,3.2 27.53,3.2 29.33,3.2 29.33,4.2 30.23,4.2 30.23,3.2 26.63,3.2 25.03,3.2 24.03,3.2 23.03,3.2 21.93,3.2 20.93,3.2 19.93,3.2 18.93,3.2 17.93,3.2 16.93,3.2 15.83,3.2 14.83,3.2 13.83,3.2 12.73,3.2 11.63,3.2 10.53,3.2
  pour Top (isolate 0.25, rank 2): 33.53,0 4.33,0 4.43,6.7 8.03,6.7 9.03,4.8 29.43,4.8 30.23,5.6 33.53,5.6
  pour Bottom (isolate 0.25, rank 2): 10.08,11.05 27.73,11.05 27.73,5 30.73,5 30.73,2.65 10.08,2.65
  pour Top (rank 2): 25.43,10.3 18.63,10.3 18.63,4.6 25.43,4.6
PWM  (via drill 0.35)
  Top 0.4: R17.2 6.33,12.75 6.65,12.43 U8.7 8.78,12.4 v10.23,12.4
  Bottom 0.4: J2.7 28.61,24.13 27.28,22.8 24.7,22 18.43,19.25 11.33,19.25 9.15,17.07 9.15,13.48 v10.23,12.4
RTDIN1+  (via drill 0.35, 0.36)
  Top 0.305: U3.7 17.41,34.94 v17.78,35.31 17.78,36.39 C5.1 | v58.55,37.78 58.86,37.47 RTD1.4
  Bottom 0.305: v17.78,35.31 22.99,40.51 43.21,40.51 43.44,40.74 44.09,40.74 44.83,40.01 53.47,40.01 57.98,37.78 v58.55,37.78
RTDIN1-  (via drill 0.35, 0.36)
  Top 0.305: U3.8 v16.76,35.31 16.76,36.39 C5.2 | RTD1.2 v58.42,38.73
  Bottom 0.305: v16.76,35.31 22.48,41.02 26.04,41.02 | 26.42,41.02 26.04,41.02 | 26.04,41.02 42.94,41.02 43.25,41.33 44.35,41.33 44.4,41.27 45.09,40.64 45.21,40.51 53.72,40.51 57.53,38.73 v58.42,38.73
RTDIN2+  (via drill 0.35, 0.36)
  Top 0.305: U4.7 26.81,34.94 v27.18,35.31 27.18,36.26 C8.1 | v58.61,35.5 59.18,34.92 RTD1.8
  Bottom 0.305: v27.18,35.31 30.35,38.48 52.7,38.48 57.72,35.5 v58.61,35.5
RTDIN2-  (via drill 0.35, 0.36)
  Top 0.305: U4.8 v26.16,35.31 26.16,36.52 C8.2 | v58.55,36.26 58.74,36.2 58.93,36.2 RTD1.6
  Bottom 0.305: v26.16,35.31 29.84,38.99 32.13,38.99 | 32.38,38.99 32.13,38.99 | v58.55,36.26 57.72,36.26 52.96,38.99 32.13,38.99
RTDIN3+  (via drill 0.35, 0.36)
  Top 0.305: U5.7 36.7,34.36 v36.7,35.31 36.7,36.39 C11.1 | RTD1.12 59.05,32.38 58.67,32.38 v58.55,32.45
  Bottom 0.305: v36.7,35.31 36.7,35.56 37.59,36.45 39.37,36.45 51.69,36.45 57.72,32.45 58.04,32.45 v58.55,32.45
RTDIN3-  (via drill 0.35, 0.36)
  Top 0.305: 36.07,35.69 U5.8 | 36.07,35.69 v36.04,35.84 | C11.2 36.07,36.52 36.07,35.69 | v58.55,33.21 59.31,33.66 RTD1.10
  Bottom 0.305: v36.04,35.84 36.07,35.94 37.08,36.96 51.94,36.96 57.72,33.21 v58.55,33.21
RTDIN4+
  Top 0.305: 45.86,35.07 U6.7 | 45.86,35.07 46.1,35.31 47.37,35.31 48.77,33.27 50.38,32.39 51.94,29.74 52.3,28.96 58.61,28.96 59.5,29.84 RTD1.16 | C14.1 45.86,36.02 45.86,35.07
RTDIN4-  (via drill 0.35, 0.36)
  Top 0.305: U6.8 v45.21,35.31 45.21,36.01 C14.2 | v58.48,30.92 58.67,31.11 RTD1.14
  Bottom 0.305: v45.21,35.31 51.31,35.31 57.72,30.92 v58.48,30.92
SCLK  (via drill 0.36)
  Top 0.305: U6.12 42.05,32.65 v41.91,32.64 | U5.12 32.91,32.65 v32.77,32.64 | U3.12 v13.34,32.64 | U4.12 23.81,32.64 v22.86,32.64 | J2.6 31.24,24.64 31.24,31.5 v30.99,31.75
  Bottom 0.305: v41.91,32.64 33.78,32.64 v32.77,32.64 30.99,32.64 | 30.99,32.64 28.45,32.64 v22.86,32.64 19.18,32.64 v13.34,32.64 | 30.99,32.64 v30.99,31.75
SIO
  Top 0.305: U2.1 21.4,41.84 | U2.1 22.67,41.84 23.5,42.67 24.89,42.67 J1.5 | U2.1 21.02,41.84 19.19,40.02 R3.1
SNUB1
  pour Top (no thermals): 43.98,13.25 43.98,9.5 41.98,9.5 41.98,13.25
TECM
  Top 0.6: C21.1 46.33,11 | 46.33,11 47.53,9.8 47.53,8.4 | 45.13,8.3 45.13,9.8 46.33,11 | 40.63,3.2 39.51,3.2 L3.1 39.76,5.3 40.63,5.3 40.63,5.9 41.43,6.7 44.13,6.7
  pour Top: 37.98,4.7 39.28,6 42.52,6 45.23,8.7 45.73,9.2 45.73,9.3 47.03,9.3 48.08,8.25 51.43,8.25 51.43,4.5 46.03,4.5 44.53,3 37.98,3
TECP
  Top 0.2: 40.83,19.8 arc90 40.93,19.7 40.93,17.1 | 45.15,17.23 arc90 44.83,17.55 D4.A
  Top 0.6: C21.2 51.63,10.3 51.63,9.8 51.53,9.7 53.43,9.7 | C21.2 52.98,11.75 53.03,11.7 | C21.2 51.63,13.4 52.93,13.4 53.03,13.3 | 40.83,19.8 39.76,19.8 L4.2 40.1,17.1 40.93,17.1
  Top 0.7: 51.26,13.47 49.6,13.47 | 51.43,10.1 50.03,10.1 | C21.2 49.76,11.75 49.6,11.9
  Top 1: 49.6,13.72 49.6,13.47 | 51.63,13.4 51.26,13.47 | 50.03,10.1 49.6,10.72 | 51.63,10.3 51.43,10.1
  Top 1.5: 49.6,13.72 49.33,14 47.73,15.4 45.15,17.23 | 49.6,13.47 49.6,11.9 49.6,10.72
  pour Top: 37.98,18.25 39.48,16.75 46.38,16.75 46.38,18.75 44.23,20 37.98,20
  pour Top: 52.33,14.3 56.03,10.7 56.03,5.2 55.33,4.5 53.73,4.5 53.73,7.5 52.43,9.2 51.03,9.2 51.03,14.3
VCC  (via drill 0.35)
  Top 0.4: U8.VCC 14.26,8.82
  Top 0.6: U8.13 11.86,6.43 14.26,8.82 | U8.3 11.7,16.43 14.26,13.88 U8.VCC U8.23
  other vias: 10.43,10 10.93,10.6 10.43,11.2 10.93,11.8 10.93,13 10.43,13.7 10.93,14.4 10.43,15.1 10.93,15.8 10.43,16.5 11.03,17.1 17.13,7.3 17.13,8 17.13,8.7 12.03,17.1 13.03,17.1 14.03,17.1 15.03,17.1 16.13,17.1 17.23,17.1 17.13,11.2 17.13,12.7 17.13,13.95 17.13,15.2 17.13,5.6 16.13,5.6 15.13,5.6 14.13,5.6 13.13,5.6 12.13,5.6 10.43,5.6 11.23,5.6
  pour Bottom: 17.53,18.7 17.53,6.4 9.23,6.4 9.23,18.7
  pour Top (rank 3, no thermals): 17.53,17.5 17.53,4 10.13,4 10.13,17.5
VIN  (via drill 0.35)
  Top 0.4: U8.12 10.26,7.43 v11.13,8.3
  Bottom 0.4: v11.13,8.3 12.23,9.4 16.73,9.4 17.73,9.4 19.03,10.7 19.53,11.2 19.53,12.9 19.16,13.27 Q3.3 20.23,13.27 | 20.23,15.8 Q3.1 | 19.73,14.5 18.33,14.5
  Bottom 0.5: 20.23,16 20.23,15.8 | Q3.2 18.33,14.5 | 20.23,13.5 20.23,13.27 | 45.73,13.1 45.43,13.1
  Bottom 0.6: 53.73,14 54.1,14 PWR.1 | 56.23,16.5 PWR.1 | PWR.1 52.76,16.5
  pour Bottom: 18.03,11.43 18.03,16.6 21.03,16.6 22.93,14.2 51.13,14.2 52.63,16.7 56.43,16.6 56.43,13.43 arc-90 54.43,11.43

### Text on the board
tPlace: Capable Robot Components / SenseTemp TEC [CRHVEF] | RTD4
bPlace: VIN | !EN | SIO | 1 | 2 | 3 | 4 | 1 | Capable Robot Components / SenseTemp TEC [CRHVEF] | 2 | 3 | 4 | GND | INA | INB | ENB | ENA | FB | PWM | SCLK | MOSI | MISO | GND | 12V | - | +